# Altium schematic sheet SCH.SchDoc
size A
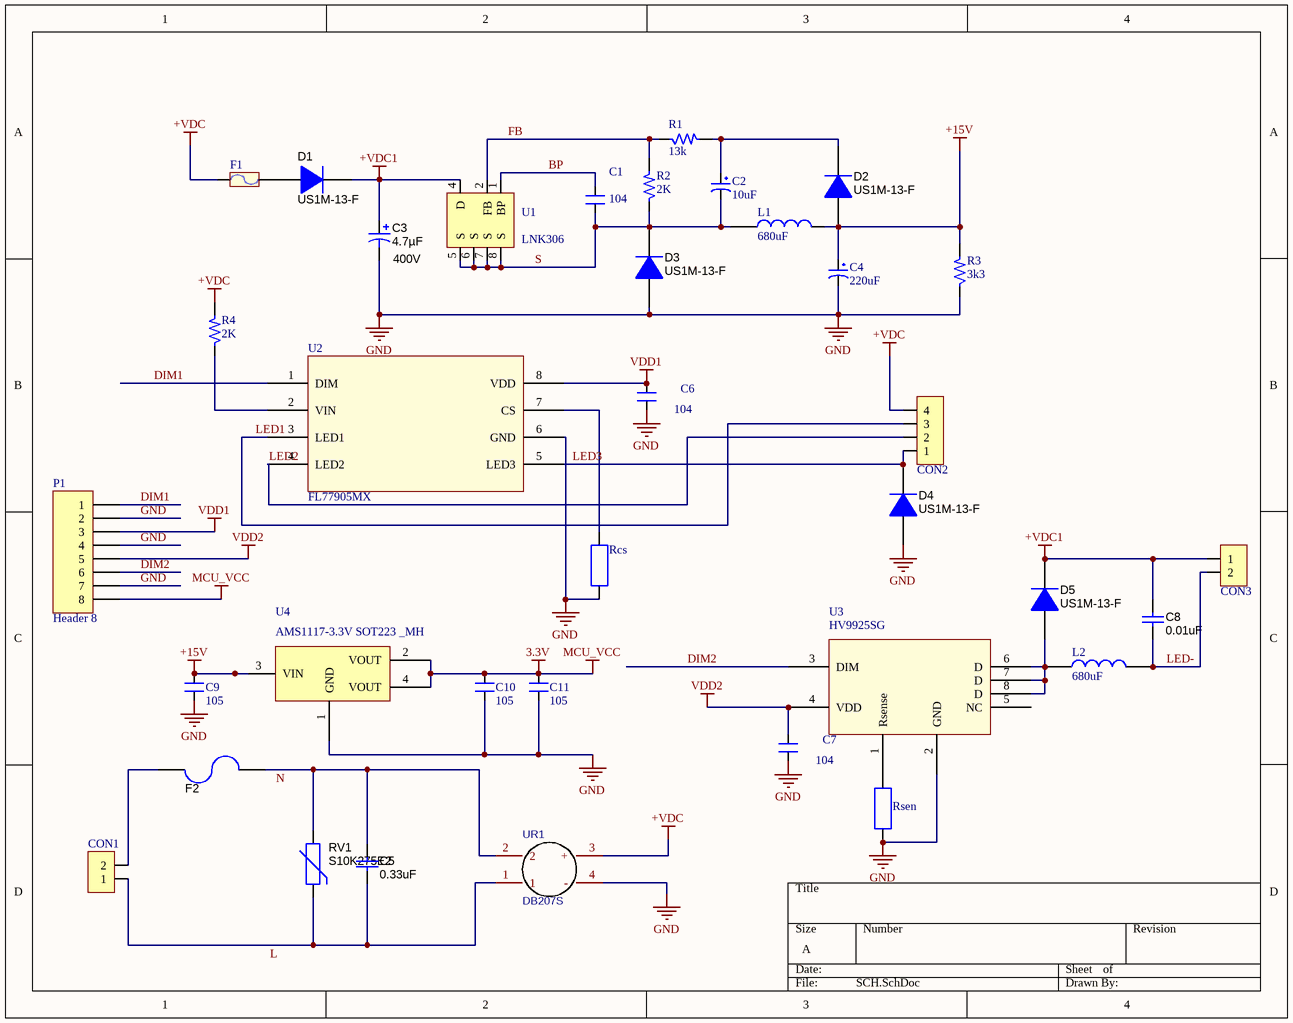
[diagram p0: SCH.SchDoc]

## Parts
C1  104  [0805_Cap]
C2  10uF  [TU_NHOM_10uF_MH]
C3  ValueDisplayed: 4.7µF  Value2: 400V  [CAP-PANACAP-G-GENERIC]  (hidden comment: 400AX6R8M8x11)
C4  220uF  [TU_NHOM_2.5_MH]
C5  value 0.33uF  [B32922_12mm]  (hidden comment: B32922C3334M189)
C6  104  [0805_HV]
C7  104  [0805_HV]
C8  value 0.01uF  [B32922_12mm]  (hidden comment: B32922C3334M189)
C9  105  [0805_HV]
C10  105  [0805_HV]
C11  105  [0805_HV]
CON1  CON 2 EDG 5.08_MH  [CON 2 EDG 5.08]  (value not drawn)
CON2  CON 4 EDG 5.08_MH  [Con 4 EDG 5.08]  (value not drawn)
CON3  CON 2 EDG 5.08_MH  [CON 2 EDG 5.08]  (value not drawn)
D1  US1M-13-F  [SMB]
D2  US1M-13-F  [SMB]
D3  US1M-13-F  [SMB]
D4  US1M-13-F  [SMB]
D5  US1M-13-F  [SMB]
F1  FUSE_AUTO_0.5A 8V 1206_MH  [FUSE 1206]  (value not drawn)
F2  37015000430  [Fuse 5x20]  (value not drawn)
L1  680uF  [Inductor 4.5x5]
L2  680uF  [Inductor 4.5x5]
P1  Header 8  [HDR1X8]
R1  13k  [0805_R]
R2  2K  [0805_R]
R3  3k3  [0805_R]
R4  2K  [1206]
Rcs  TRO_CS_2W_MH  [TRO_VACH_2W]  (value not drawn)
Rsen  TRO_CS_2W_MH  [TRO_VACH_2W]  (value not drawn)
RV1  S10K275E2  [VAR_S10K275E2]
U1  LNK306  [SOP 7]
U2  FL77905MX  [SOP 8]
U3  HV9925SG  [SOP 8]
U4  AMS1117-3.3V SOT223 _MH  [SOT223]
UR1  DB207S  [DB207S]

## Nets
3.3V: C10.2 C11.2 P1.8 U4.2(VOUT) U4.4(VOUT)  [also labelled MCU_VCC]
+15V: C4.1 C9.2 D2.2(A) L1.2 R3.2 U4.3(VIN)
+VDC: CON2.4 F1.1 R4.2 UR1.3(+)
+VDC1: C3.1(+) C8.2 CON3.1 D1.1(K) D5.1(K) U1.4(D)
GND: C3.2(-) C4.2 C6.1 C7.1 C9.1 C10.1 C11.1 D3.2(A) D4.2(A) P1.2 P1.4 P1.7 R3.1 Rcs.1 Rsen.1 U2.6(GND) U3.2(GND) U4.1(GND) UR1.4(-)
VDD1: C6.2 P1.3 U2.8(VDD)
VDD2: C7.2 P1.5 U3.4(VDD)
BP: C1.2 U1.1(BP)
DIM1: P1.1 U2.1(DIM)
DIM2: P1.6 U3.3(DIM)
FB: R1.1 R2.2 U1.2(FB)
L: C5.1 CON1.1 RV1.2 UR1.1
LED1: CON2.3 U2.3(LED1)
LED2: CON2.2 U2.4(LED2)
LED3: CON2.1 D4.1(K) U2.5(LED3)
LED-: C8.1 CON3.2 L2.2
N: C5.2 F2.1 RV1.1 UR1.2
S: C1.1 C2.2 D3.1(K) L1.1 R2.1 U1.5(S) U1.6(S) U1.7(S) U1.8(S)
NetC2_1: C2.1 D2.1(K) R1.2
NetCON1_2: CON1.2 F2.2
NetD1_2: D1.2(A) F1.2
NetD5_2: D5.2(A) L2.1 U3.6(D) U3.7(D) U3.8(D)
NetR4_1: R4.1 U2.2(VIN)
NetRcs_2: Rcs.2 U2.7(CS)
NetRsen_2: Rsen.2 U3.1(Rsense)

Not connected (* = marked no-connect by the designer): U3 5(NC)

## Library data of the parts
C1 C6 C7 C9-C11 = CM: Cap SMD; Value: 103
C2 = TU_NHOM_10uF_25V_MH: Value: 47uF/16 - 50V; Description 1: 470uF/6,3V - 330uF/10V - 220uF/16V; Description 2: 100uF/25V - 35V - 47uF/50V - 22uF/100V; Description 3: 33uF => 47uF/63V - 1uF => 4,7uF/160V; Description 4: 1uF => 2,2uF/250V - 1uF/350V
C3 = 400AX6R8M8x11: CAP, AL, 6.8uF, 400V, +/-20%, TH; Manufacturer: Rubycon; Polarized: Y; CompType: Capacitor; U/M: EA; Cap_F: 0.0000068; Tolerance_%: 20; Value1: Unknown; VDC_V: 400; TaMin_C: -40; TaMax_C: 105; Cap_Case: 8x11; SymbolVersion: 2008-07-09; Value: 6.8uF; PartNumber: 400AX6R8M8x11; PackageReference: 8x11; RoHS: Y; MountType: TH; Technology: AL; Series: AX; Publisher: Texas Instruments; LatestRevisionDate: 2013-08-02; ComponentLink1Description: Datasheet link; ComponentLink1URL: http://www.rubycon.co.jp/de/catalog/e_pdfs/aluminum/e_ax.pdf
C4 = TU_NHOM_220uF_25V_MH: LINK: https://item.taobao.com/item.htm?spm=a230r.1.14.282.6c612953FsebRk&id=546158429968&ns=1&abbucket=10#detail
C5 C8 = BFC233620154: CAP FILM 0.33UF 630VDC RADIAL; Manufacturer: EPCOS(TDK); CompType: Film Capacitor; SymbolCreator: x0199378; PartNumber: B32922C3334M189; RoHS: Y; MountType: TH; ComponentLink1Description: Datasheet link; ComponentLink1URL: http://en.tdk.eu/inf/20/20/db/fc_2009/X2_B32921_928.pdf; SymbolVersion: 2015-01-29
CON1 CON3 = CON 2 EDG 5.08_MH: CON 2 EDG 5.08 (xanh cong)
CON2 = CON 4 EDG 5.08_MH: CON 4 EDG 5.08 (xanh cong)
D1-D5 = MURS160-13-F: Diode, Ultrafast, 600V, 1A, SMB; Manufacturer: Diodes Inc.; U/M: EA; Vf_V: 1.25; Value2: 1.25V; Io_A: 1; Vr_V: 600; TJmax_C: 150; RJC_CperW: 13; PartNumber: US1M-13-F; CompType: Diode; SymbolVersion: 2008-12-08; MountType: SMT; RoHS: Y; Value: 600V; PackageReference: SMB; Value1: 1A; Type: Ultrafast; Published: 2008-06-26; Publisher: Texas Instruments; LatestRevisionDate: 2013-06-21; ComponentLink1Description: Datasheet link; ComponentLink1URL: http://www.diodes.com/datasheets/ds30130.pdf; Supplier 1: Digi-Key; Supplier 2: Mouser; Supplier 3: Farnell
F1 = FUSE_AUTO_0.5A 8V 1206_MH: Fuse
F2 = 0216008.MXESPP: FUSE BOARD MOUNT 5A 250VAC RAD; Manufacturer: Littelfuse Inc; U/M: EA; VDC_V: 250; Irating_A: 5; Rtyp_Ohm: 0.0123; Soldering_Wave_MaxTemp_C: 260; SymbolVersion: 2008-07-09; PartNumber: 37015000430; PackageReference: Radial, Can, Vertical; CompType: Fuse; Published: 2009-03-05; RoHS: Y; VAC_V: 250; Publisher: Texas Instruments; LatestRevisionDate: 2014-04-17; ComponentLink1Description: Datasheet link; ComponentLink1URL: http://www.littelfuse.com/~/media/electronics/datasheets/fuses/littelfuse_fuse_370_datasheet.pdf.pdf; Soldering_Wave_MaxTime_s: 5; MountType: TH; Supplier 1: Digi-Key; Supplier Part Number 1: F4482-ND
L1 L2 = Inductor 4.5x5_MH
P1 = Header 8: Header, 8-Pin; LatestRevisionDate: 17-Jul-2002; LatestRevisionNote: Re-released for DXP Platform.; Publisher: Altium Limited
R1-R4 = R: Resistor 1/4W; Value: R1/4W - 1K
Rcs Rsen = TRO_CS_2W_MH: Value: V?
RV1 = S10K275E2: Varistor 275V RMS 10MM Radial, TH; Manufacturer: EPCOS Inc; SymbolCreator: a0412235; SymbolVersion: 2012-06-04; PartNumber: S10K275E2; MountType: TH; ComponentLink1Description: Datasheet URL; ComponentLink1URL: http://www.epcos.com/inf/70/db/var_08/SIOV_Leaded_AdvanceD.pdf; RoHS: Y; PackageReference: 10mm Radial; Publisher: Texas Instruments; LatestRevisionDate: 2013-02-24; Supplier 1: Digi-Key; Supplier Part Number 1: 495-1433-ND
U1 = Component_1
U2 = FL77905
U3 = HV9925
UR1 = DB207S: BOM_Manufacturer: DYELEC; SMT Type: Extend; BOM_Supplier: LCSC; BOM_Manufacturer Part: DB207S; image: //image.lceda.cn/szlcsc/C84160.jpg; BOM_Supplier Part: C84160; BOM_LCSC Assembly: Yes; spicePre: U